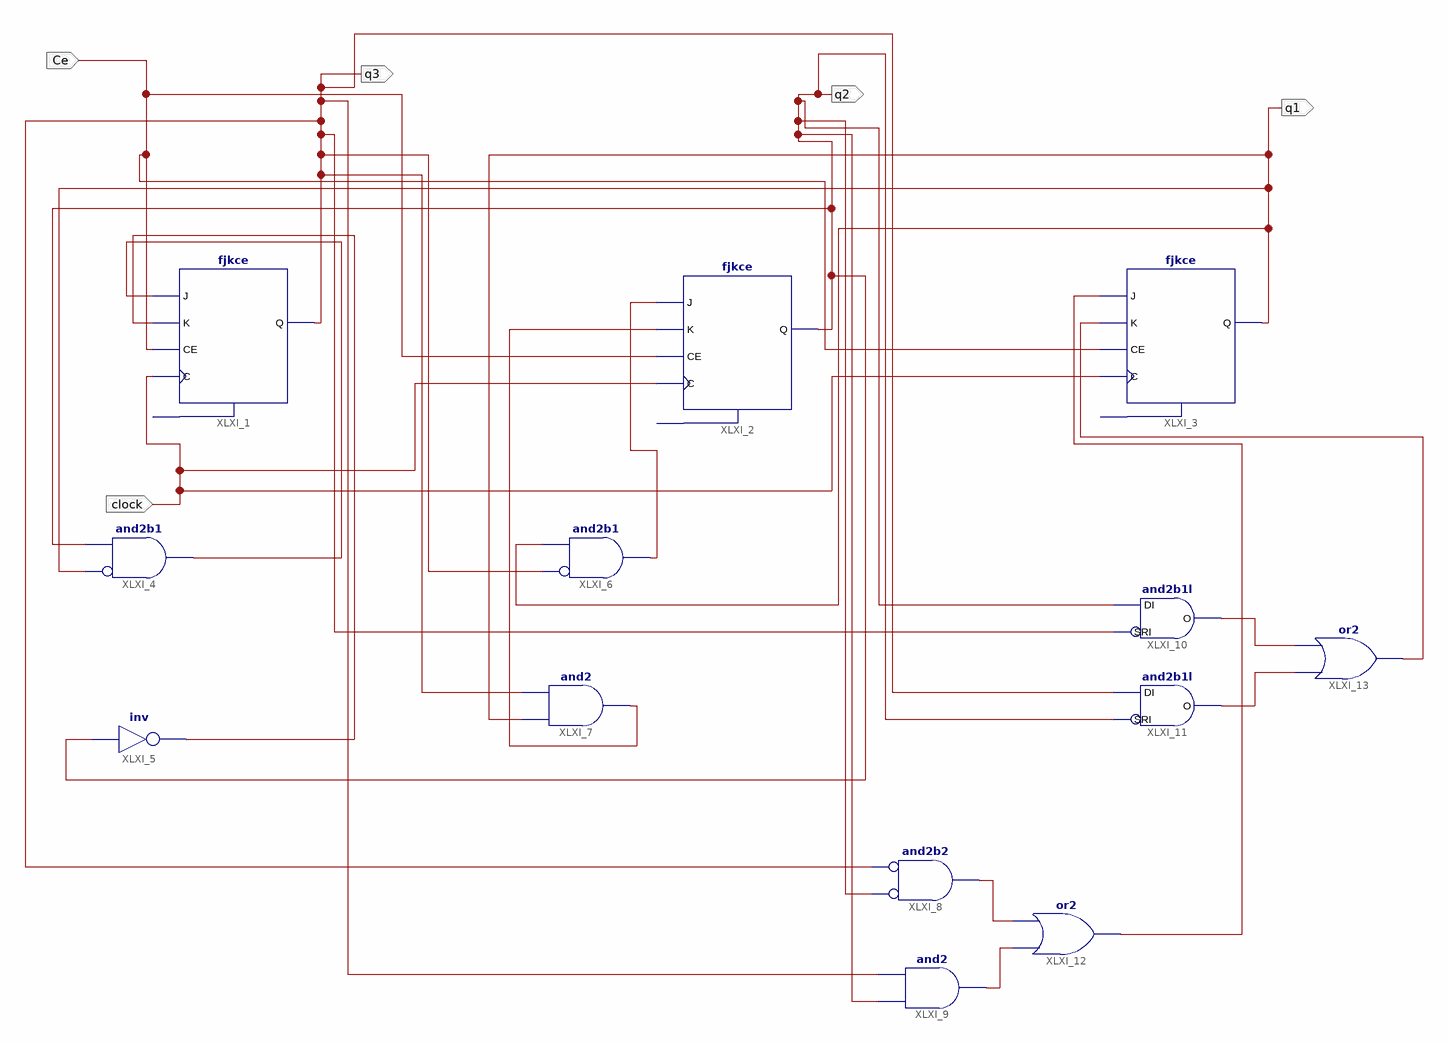
[diagram p0: schematic sheet 1]
// Xilinx ISE schematic liczniik.sch (aspartan6) as structural Verilog: 13 symbols, 5 ports
module liczniik (
  input  Ce,
  input  clock,
  output q3,
  output q2,
  output q1
);

  wire XLXN_13, XLXN_15, XLXN_18, XLXN_20, XLXN_21, XLXN_22, XLXN_23, XLXN_24, XLXN_25, XLXN_26;

  fjkce XLXI_1 (.C(clock), .CE(Ce), .J(XLXN_13), .K(XLXN_15), .Q(q3));  // open: CLR
  fjkce XLXI_2 (.C(clock), .CE(Ce), .J(XLXN_18), .K(XLXN_20), .Q(q2));  // open: CLR
  fjkce XLXI_3 (.C(clock), .CE(Ce), .J(XLXN_23), .K(XLXN_26), .Q(q1));  // open: CLR
  and XLXI_4 (XLXN_13, ~q1, q2);  // and2b1
  not XLXI_5 (XLXN_15, q2);
  and XLXI_6 (XLXN_18, ~q3, q1);  // and2b1
  and XLXI_7 (XLXN_20, q1, q3);
  and XLXI_8 (XLXN_21, ~q2, ~q3);  // and2b2
  and XLXI_9 (XLXN_22, q2, q3);
  and2b1l XLXI_10 (.SRI(q3), .DI(q2), .O(XLXN_24));
  and2b1l XLXI_11 (.SRI(q2), .DI(q3), .O(XLXN_25));
  or XLXI_12 (XLXN_23, XLXN_22, XLXN_21);
  or XLXI_13 (XLXN_26, XLXN_25, XLXN_24);
endmodule
